# EAGLE design rcmix_v1 (EAGLE 7.3.0)
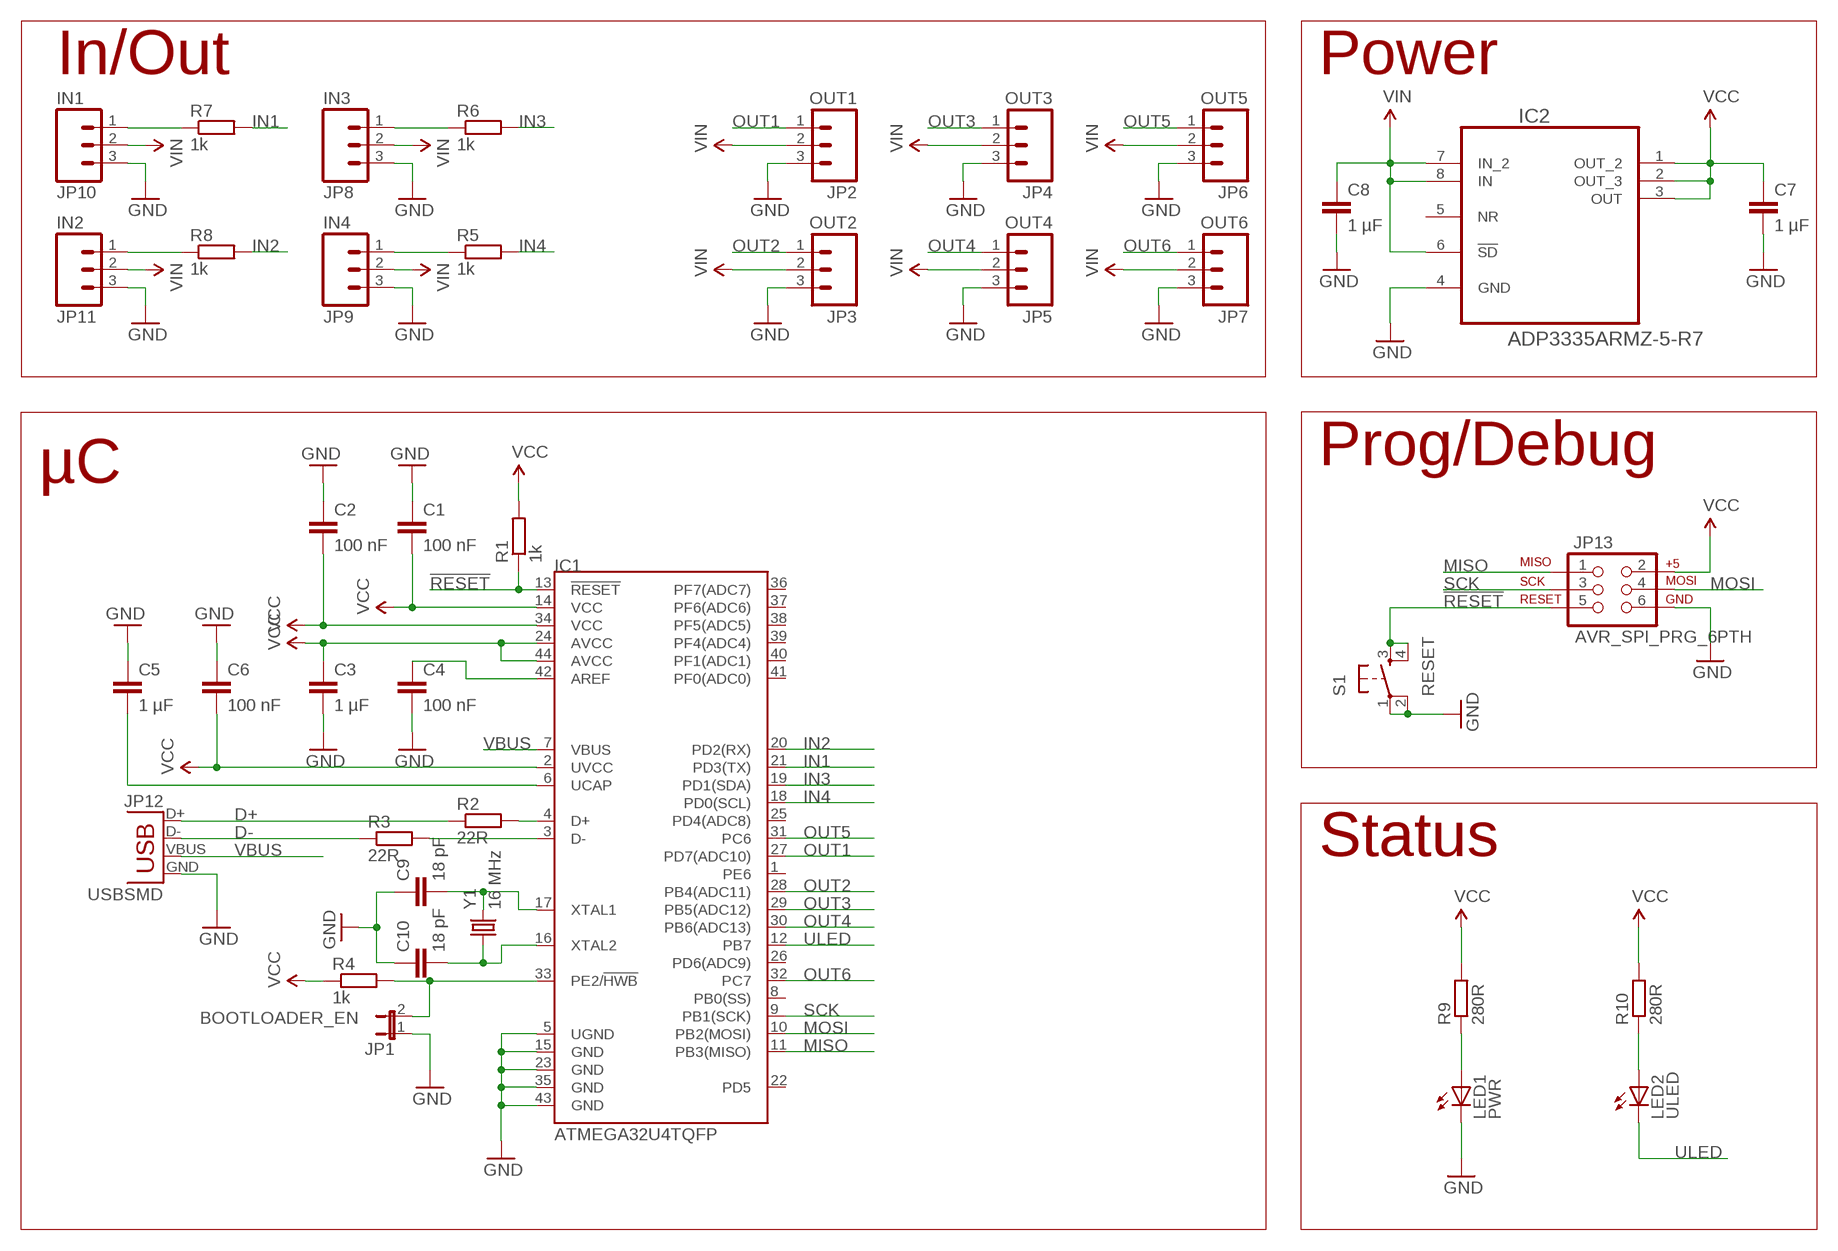
[diagram p0: schematic, sheet 1]

## Parts
C1  100 nF  C-EUC0603K  [C0603K]
C2  100 nF  C-EUC0603K  [C0603K]
C3  1 µF  C-EUC0603K  [C0603K]
C4  100 nF  C-EUC0603K  [C0603K]
C5  1 µF  C-EUC0603K  [C0603K]
C6  100 nF  C-EUC0603K  [C0603K]
C7  1 µF  C-EUC0603K  [C0603K]
C8  1 µF  C-EUC0603K  [C0603K]
C9  18 pF  C-EUC0603K  [C0603K]
C10  18 pF  C-EUC0603K  [C0603K]
IC1  ATMEGA32U4TQFP  [SPARKFUN-DIGITALIC_TQFP44]
IC2  ADP3335ARMZ-5-R7  [SOP65P490X110-8N]
JP1  BOOTLOADER_EN  JP1E  [JP1]
JP2  OUT1  M03PTH  [1X03]
JP3  OUT2  M03PTH  [1X03]
JP4  OUT3  M03PTH  [1X03]
JP5  OUT4  M03PTH  [1X03]
JP6  OUT5  M03PTH  [1X03]
JP7  OUT6  M03PTH  [1X03]
JP8  IN3  M03PTH  [1X03]
JP9  IN4  M03PTH  [1X03]
JP10  IN1  M03PTH  [1X03]
JP11  IN2  M03PTH  [1X03]
JP12  USBSMD  [USB-MINIB]
JP13  AVR_SPI_PRG_6PTH  [2X3]
LED1  PWR  LEDCHIP-LED0603  [CHIP-LED0603]
LED2  ULED  LEDCHIP-LED0603  [CHIP-LED0603]
R1  1k  R-EU_R0603  [R0603]
R2  22R  R-EU_R0603  [R0603]
R3  22R  R-EU_R0603  [R0603]
R4  1k  R-EU_R0603  [R0603]
R5  1k  R-EU_R0603  [R0603]
R6  1k  R-EU_R0603  [R0603]
R7  1k  R-EU_R0603  [R0603]
R8  1k  R-EU_R0603  [R0603]
R9  280R  R-EU_R0603  [R0603]
R10  280R  R-EU_R0603  [R0603]
S1  RESET  TAC_SWITCHPTH  [TACTILE-PTH]
Y1  16 MHz  CRYSTALTXC-7A  [CRYSTAL-TXC-7A]

## Nets
!RESET: IC1.13(!RESET) JP13.5 R1.1 S1.3 S1.4
D+: JP12.D+ R2.1
D-: JP12.D- R3.1
GND: C1.1 C2.1 C3.2 C4.2 C5.1 C6.1 C7.2 C8.2 C9.1 C10.1 IC1.5(UGND) IC1.15(GND) IC1.23(GND) IC1.35(GND) IC1.43(GND) IC2.4(GND) JP1.1 JP2.3 JP3.3 JP4.3 JP5.3 JP6.3 JP7.3 JP8.3 JP9.3 JP10.3 JP11.3 JP12.GND JP13.6 LED1.C S1.1 S1.2
IN1: IC1.21(PD3(TX)) R7.2
IN2: IC1.20(PD2(RX)) R8.2
IN3: IC1.19(PD1(SDA)) R6.2
IN4: IC1.18(PD0(SCL)) R5.2
MISO: IC1.11(PB3(MISO)) JP13.1
MOSI: IC1.10(PB2(MOSI)) JP13.4
N$1: IC1.4(D+) R2.2
N$2: IC1.3(D-) R3.2
N$3: C4.1 IC1.42(AREF)
N$5: C5.2 IC1.6(UCAP)
N$6: IC1.33(PE2/!HWB) JP1.2 R4.2
N$7: JP10.1 R7.1
N$8: JP11.1 R8.1
N$9: JP8.1 R6.1
N$10: JP9.1 R5.1
N$11: C9.2 IC1.17(XTAL1) Y1.P$2
N$12: LED1.A R9.1
N$13: C10.2 IC1.16(XTAL2) Y1.P$1
N$14: LED2.A R10.1
OUT1: IC1.27(PD7(ADC10)) JP2.1
OUT2: IC1.28(PB4(ADC11)) JP3.1
OUT3: IC1.29(PB5(ADC12)) JP4.1
OUT4: IC1.30(PB6(ADC13)) JP5.1
OUT5: IC1.31(PC6) JP6.1
OUT6: IC1.32(PC7) JP7.1
SCK: IC1.9(PB1(SCK)) JP13.3
ULED: IC1.12(PB7) LED2.C
VBUS: IC1.7(VBUS) JP12.VBUS
VCC: C1.2 C2.2 C3.1 C6.2 C7.1 IC1.2(UVCC) IC1.14(VCC) IC1.24(AVCC) IC1.34(VCC) IC1.44(AVCC) IC2.1(OUT_2) IC2.2(OUT_3) IC2.3(OUT) JP13.2 R1.2 R4.1 R9.2 R10.2
VIN: C8.1 IC2.6(!SD) IC2.7(IN_2) IC2.8(IN) JP2.2 JP3.2 JP4.2 JP5.2 JP6.2 JP7.2 JP8.2 JP9.2 JP10.2 JP11.2
Unconnected: IC1.1(PE6) IC1.8(PB0(SS)) IC1.22(PD5) IC1.25(PD4(ADC8)) IC1.26(PD6(ADC9)) IC1.36(PF7(ADC7)) IC1.37(PF6(ADC6)) IC1.38(PF5(ADC5)) IC1.39(PF4(ADC4)) IC1.40(PF1(ADC1)) IC1.41(PF0(ADC0)) IC2.5(NR)

## Notes on the sheet
- In/Out | Power
- µC | Prog/Debug
- Status

## Library data of the parts
C1-C10 = resistor:C-EU: CAPACITOR, European symbol
IC1 = SparkFun-DigitalIC:ATMEGA32U4: Atmel 44-pin 8-bit Microcontroller with 32KBytes of ISP Flash and USB Controller ----- Please use the QFN-44-NOPAD_1:1 package for the footprint of all boards using a 32U4. Route traces directly away from the pads as much as possible.; PROD_ID: IC-11161
IC2 = lxrobotics_ic:ADP3335ARMZ-5-R7: LDO, 5V, 500MA, 8-MSOP; MPN: ADP3335ARMZ-5-R7; OC_FARNELL: 2074873; OC_NEWARK: 67W2717; PACKAGE: 8-MSOP; SUPPLIER: ANALOG DEVICES
JP1 = jumper:JP1E: JUMPER
JP2-JP11 = SparkFun-Connectors:M03: Header 3 Standard 3-pin 0.1" header. Use with straight break away headers (SKU : PRT-00116), right angle break away headers (PRT-00553), swiss pins (PRT-00743), machine pins (PRT-00117), and female headers (PRT-00115). Molex polarized connector foot print use with SKU : PRT-08232 with associated crimp pins and housings.
JP12 = SparkFun-Connectors:USB: USB Connectors USB-B-PTH is fully proven SKU : PRT-00139/CONN-08278 USB-miniB is fully proven SKU : PRT-00587 USB-A-PCB is untested. USB-A-H is throughly reviewed, but untested. Spark Fun Electronics SKU : PRT-00437 USB-B-SMT is throughly reviewed, but untested. Needs silkscreen touching up. USB-A-S has not been used/tested USB-MB-H has not been used/tested USB-MICROB has been used. CONN-09505; PROD_ID: CONN-08193
JP13 = SparkFun-Connectors:AVR_SPI_PRG_6: AVR ISP 6 Pin This is the reduced ISP connector for AVR programming. Common on Arduino. This footprint will take up less PCB space and can be used with a 10-pin to 6-pin adapter such as SKU: BOB-08508 **Special note about "TEST_POINT" package. The stop mask is on the top side, so if you want your programming test points to be on the bottom of your board, make sure to place this package on the bottom side of the board. This also ensure that the orientation to program from the bottom side will be correct.
LED1 LED2 = led:LED: LED OSRAM: - CHIPLED LG R971, LG N971, LY N971, LG Q971, LY Q971, LO R971, LY R971 LH N974, LH R974 LS Q976, LO Q976, LY Q976 LO Q996 - Hyper CHIPLED LW Q18S LB Q993, LB Q99A, LB R99A - SideLED LS A670, LO A670, LY A670, LG A670, LP A670 LB A673, LV A673, LT A673, LW A673 LH A674 LY A675 LS A676, LA A676, LO A676, LY A676, LW A676 LS A679, LY A679, LG A679 - Hyper Micro SIDELED® LS Y876, LA Y876, LO Y876, LY Y876 LT Y87S - SmartLED LW L88C, LW L88S LB L89C, LB L89S, LG L890 LS L89K, LO L89K, LY L89K LS L896, LA L896, LO L896, LY L896 - TOPLED LS T670, LO T670, LY T670, LG T670, LP T670 LSG T670, LSP T670, LSY T670, LOP T670, LYG T670 LG T671, LOG T671, LSG T671 LB T673, LV T673, LT T673, LW T673 LH T674 LS T676, LA T676, LO T676, LY T676, LB T676, LH T676, LSB T676, LW T676 LB T67C, LV T67C, LT T67C, LS T67K, LO T67K, LY T67K, LW E67C LS E67B, LA E67B, LO E67B, LY E67B, LB E67C, LV E67C, LT E67C LW T67C LS T679, LY T679, LG T679 LS T770, LO T770, LY T770, LG T770, LP T770 LB T773, LV T773, LT T773, LW T773 LH T774 LS E675, LA E675, LY E675, LS T675 LS T776, LA T776, LO T776, LY T776, LB T776 LHGB T686 LT T68C, LB T68C - Hyper Mini TOPLED® LB M676 - Mini TOPLED Santana® LG M470 LS M47K, LO M47K, LY M47K Source: http://www.osram.convergy.de LUXEON: - LUMILED® LXK2-PW12-R00, LXK2-PW12-S00, LXK2-PW14-U00, LXK2-PW14-V00 LXK2-PM12-R00, LXK2-PM12-S00, LXK2-PM14-U00 LXK2-PE12-Q00, LXK2-PE12-R00, LXK2-PE12-S00, LXK2-PE14-T00, LXK2-PE14-U00 LXK2-PB12-K00, LXK2-PB12-L00, LXK2-PB12-M00, LXK2-PB14-N00, LXK2-PB14-P00, LXK2-PB14-Q00 LXK2-PR12-L00, LXK2-PR12-M00, LXK2-PR14-Q00, LXK2-PR14-R00 LXK2-PD12-Q00, LXK2-PD12-R00, LXK2-PD12-S00 LXK2-PH12-R00, LXK2-PH12-S00 LXK2-PL12-P00, LXK2-PL12-Q00, LXK2-PL12-R00 Source: www.luxeon.com KINGBRIGHT: KA-3528ASYC Source: www.kingbright.com
R1-R10 = resistor:R-EU_: RESISTOR, European symbol
S1 = SparkFun-Retired:TAC_SWITCH: Momentary Switch Button commonly used for reset or general input. Spark Fun Electronics SKU : COM-00097 SMT- SWCH-08247
Y1 = SparkFun-FreqCtrl:CRYSTAL: Various standard crystals. Proven footprints.

## Board
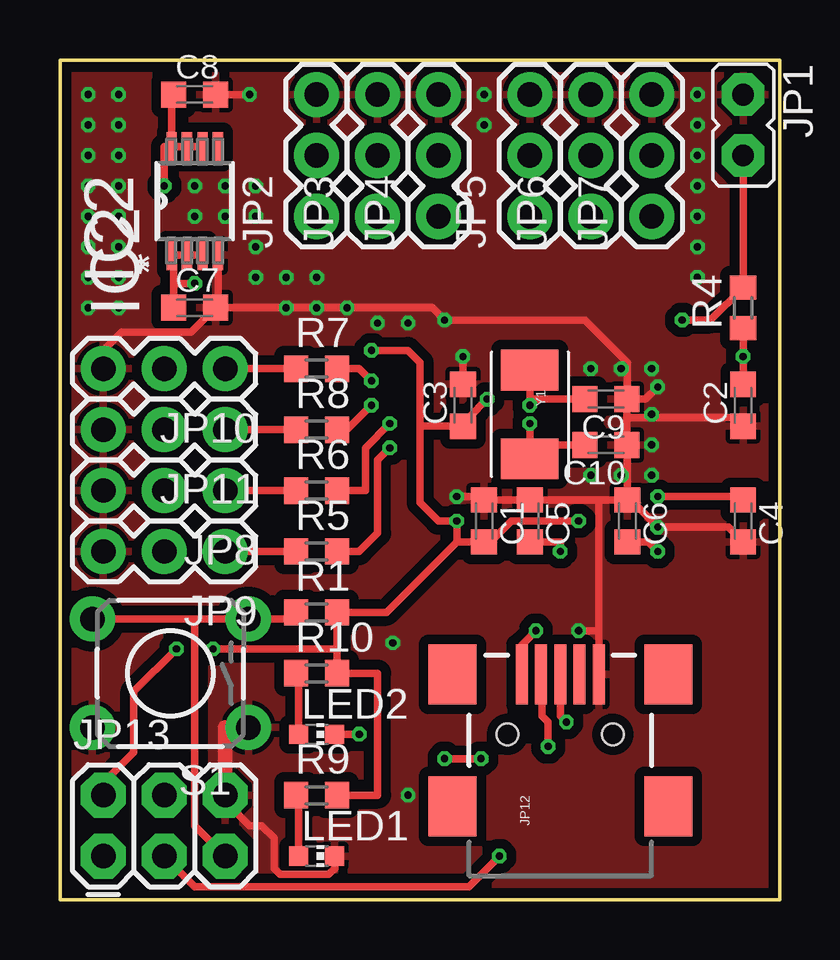
[diagram p1: board, top side]
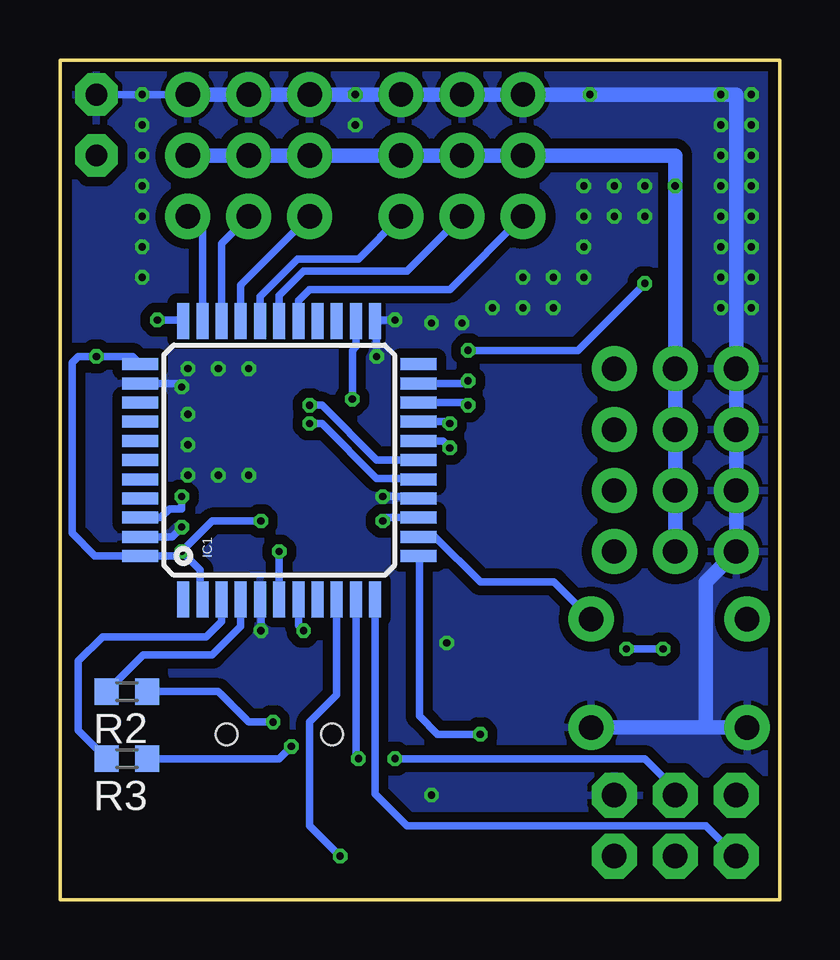
[diagram p2: board, bottom side, seen from below]

Size 30 x 35 mm. Coordinates in mm from the lower left corner, seen from the top.
Outline: 0,0 0,35 30,35 30,0 0,0
Copper layers (1*16): Top 0.035mm / dielectric 1.5mm / Bottom 0.035mm
Design rules "Eagle-DRU - 1506 - LeitOn - 01 and 02 layers - STANDARD": minimum track width 0.15mm, minimum drill 0.3mm, track to track 0.15mm, track to pad 0.15mm, pad to pad 0.15mm, via to via 0.15mm, smd to smd 0.15mm, copper to edge 0.2mm, drill to drill 0.25mm, minimum pad ring 0.15mm, minimum via ring 0.15mm, stop-mask expansion 0.05mm, vias tented up to drill 0mil, thermal gap 0.2mm

### Footprints (pad centres in the part's own frame; a part is rotated, then mirrored left to right if it is on the bottom)
C0603K = smd 1.05 x 1.08: 1 -0.875,0; 2 0.875,0
SPARKFUN-DIGITALIC_TQFP44 = smd 1.5 x 0.5: 1 -5.8,4; 2 -5.8,3.2; 3 -5.8,2.4; 4 -5.8,1.6; 5 -5.8,0.8; 6 -5.8,0; 7 -5.8,-0.8; 8 -5.8,-1.6; 9 -5.8,-2.4; 10 -5.8,-3.2; 11 -5.8,-4; 23 5.8,-4; 24 5.8,-3.2; 25 5.8,-2.4; 26 5.8,-1.6; 27 5.8,-0.8; 28 5.8,0; 29 5.8,0.8; 30 5.8,1.6; 31 5.8,2.4; 32 5.8,3.2; 33 5.8,4 | smd 0.5 x 1.5: 12 -4,-5.8; 13 -3.2,-5.8; 14 -2.4,-5.8; 15 -1.6,-5.8; 16 -0.8,-5.8; 17 0,-5.8; 18 0.8,-5.8; 19 1.6,-5.8; 20 2.4,-5.8; 21 3.2,-5.8; 22 4,-5.8; 34 4,5.8; 35 3.2,5.8; 36 2.4,5.8; 37 1.6,5.8; 38 0.8,5.8; 39 0,5.8; 40 -0.8,5.8; 41 -1.6,5.8; 42 -2.4,5.8; 43 -3.2,5.8; 44 -4,5.8
SOP65P490X110-8N = smd 1.245 x 0.432: 1 -2.261,0.965; 2 -2.261,0.33; 3 -2.261,-0.33; 4 -2.261,-0.965; 5 2.261,-0.965; 6 2.261,-0.33; 7 2.261,0.33; 8 2.261,0.965
JP1 = drill 0.914 pad 1.778 octagon: 1 0,-1.27; 2 0,1.27
1X03 = drill 1.016 pad 1.88: 1 0,0; 2 2.54,0; 3 5.08,0
USB-MINIB = smd 2.5 x 0.5: D+ 2.5,0; D- 2.5,0.8; GND 2.5,-1.6; ID 2.5,-0.8; VBUS 2.5,1.6 | smd 2.5 x 2: MTN1 -3,4.5; MTN2 2.5,4.5; MTN3 -3,-4.5; MTN4 2.5,-4.5 | hole 0.9: 0,2.2; 0,-2.2
2X3 = drill 1.016 pad 1.88 octagon: 1 0,0; 2 0,2.54; 3 2.54,0; 4 2.54,2.54; 5 5.08,0; 6 5.08,2.54
CHIP-LED0603 = smd 0.8 x 0.8: A 0,-0.75; C 0,0.75
R0603 = smd 1 x 1.1: 1 -0.85,0; 2 0.85,0
TACTILE-PTH = drill 1.016 pad 1.88: 1 -3.251,2.261; 2 3.251,2.261; 3 -3.251,-2.261; 4 3.251,-2.261
CRYSTAL-TXC-7A = smd 1.7 x 2.4: P$1 1.85,0; P$2 -1.85,0

### Placement (x,y rotation side)
C1  17.68,15.78 270 top
C2  28.48,20.61 90 top
C3  16.8,20.61 90 top
C4  28.48,15.78 270 top
C5  19.59,15.78 270 top
C6  23.65,15.78 270 top
C7  5.62,24.67 0 top
C8  5.62,33.56 0 top
C9  22.77,20.86 180 top
C10  22.77,18.95 180 top
IC1  20.86,18.32 90 bottom
IC2  5.62,29.11 90 top
JP1  28.48,32.29 180 top
JP2  10.7,28.48 90 top
JP3  13.24,28.48 90 top
JP4  15.78,28.48 90 top
JP5  19.59,28.48 90 top
JP6  22.13,28.48 90 top
JP7  24.67,28.48 90 top
JP8  6.89,17.05 180 top
JP9  6.89,14.51 180 top
JP10  6.89,22.13 180 top
JP11  6.89,19.59 180 top
JP12  20.86,6.89 90 top
JP13  1.81,1.81 0 top
LED1  10.7,1.81 270 top
LED2  10.7,6.89 270 top
R1  10.7,11.97 0 top
R2  27.21,8.67 180 bottom
R3  27.21,5.87 180 bottom
R4  28.48,24.67 90 top
R5  10.7,14.51 0 top
R6  10.7,17.05 0 top
R7  10.7,22.13 0 top
R8  10.7,19.59 0 top
R9  10.7,4.35 0 top
R10  10.7,9.43 0 top
S1  4.6,9.43 180 top
Y1  19.59,20.23 270 top

### Tracks (layer width: path | path; a pad name or v marks a point on that pad's centre or on a via)
!RESET
  Top 0.305: S1.4 5.62,11.69 | 5.62,11.69 S1.3 9.57,11.69 R1.1 | JP13.5 5.62,3.08 5.62,11.69
  Bottom 0.305: S1.3 9.4,13.24 12.48,13.24 14.36,15.12 IC1.13
D+  (via drill 0.3)
  Top 0.305: JP12.D+ 20.86,7.65 v21.11,7.4
  Bottom 0.305: v21.11,7.4 22.13,7.4 23.4,8.67 R2.1
D-  (via drill 0.3)
  Top 0.305: v20.35,6.38 20.35,7.4 20.1,7.65 20.1,9.35 JP12.D-
  Bottom 0.305: R3.1 20.86,5.87 v20.35,6.38
GND  (via drill 0.3)
  Top 0.305: JP13.6 6.89,4.1 7.91,3.08 8.41,3.08 8.92,2.57 8.92,1.3 9.18,1.05 11.21,1.05 11.46,1.3 11.46,1.8 LED1.C | 22.46,11.13 JP12.GND | C9.1 23.64,20.1 | 23.64,20.1 C10.1 23.65,18.94 C6.1 | v24.92,21.37 24.42,20.86 C9.1 | 22.46,16.66 C5.1 C1.1 17.54,16.8 v16.54,16.8 | 22.46,11.13 22.38,11.21 v21.62,11.21 | C6.1 22.46,16.66 | 22.46,16.66 22.46,11.13 | C6.1 23.8,16.66 v24.92,15.53 27.86,15.53 C4.2 | C2.1 28.37,20.1 23.64,20.1 | C7.2 6.59,24.67 IC2.4 | JP10.3 1.81,22.89 2.57,23.65 5.48,23.65 C7.2 | C8.2 v7.91,33.56 | C7.2 15.53,24.67 v16.03,24.16 21.88,24.16 23.65,22.38 23.65,20.87 C9.1 | C3.2 v16.8,22.64
  Top 0.61: JP13.6 6.89,7.17 S1.1
  Bottom 0.305: IC1.5 21.62,12.48 v21.62,11.21 | IC1.35 25.08,21.52 v24.92,21.37 | v16.54,16.8 15.06,16.8 IC1.15 | IC1.43 25.33,15.12 v24.92,15.53 | JP7.3 JP1.1 | v16.03,24.16 16.82,24.16 IC1.23 arc90 16.8,24.06 v16.8,22.64
  Bottom 0.61: S1.1 3.08,7.17 | 3.08,7.17 S1.2 | 3.08,7.17 3.08,13.24 JP9.3 JP8.3 JP11.3 JP10.3 1.81,33.56 v7.91,33.56 JP2.3 JP3.3 JP4.3 JP5.3 JP6.3 JP7.3
  other vias: 1.17,33.56 2.45,33.56 1.17,32.29 2.45,32.29 2.45,31.02 1.17,31.02 1.17,29.75 2.45,29.75 2.45,28.48 1.17,28.48 1.17,27.21 2.45,27.21 2.45,25.94 1.17,25.94 1.17,24.67 2.45,24.67 5.62,29.75 6.89,29.75 6.89,28.48 5.62,28.48 8.16,29.75 8.16,28.48 8.16,27.21 8.16,25.94 9.43,25.94 10.7,25.94 9.43,24.67 10.7,24.67 11.97,24.67 13.24,24.04 14.51,24.04 17.68,33.56 17.68,32.29 26.57,33.56 26.57,32.29 26.57,31.02 26.57,29.75 26.57,28.48 26.57,27.21 26.57,25.94 14.51,4.35 13.88,10.7 22.13,22.13 23.4,22.13 24.67,22.13 24.67,20.23 24.67,18.95 24.67,17.68 23.4,17.68 22.13,17.68
  pour Bottom (isolate 0.406): 0,35 30,35 30,0 0,0
  pour Top (isolate 0.406): 0,0 30,0 30,35 0,35
IN1  (via drill 0.3)
  Top 0.305: R7.2 12.48,22.13 v12.99,21.62
  Bottom 0.305: v12.99,21.62 13.09,21.52 IC1.21
IN2  (via drill 0.3)
  Top 0.305: R8.2 11.97,19.59 v12.99,20.61
  Bottom 0.305: v12.99,20.61 13.1,20.72 IC1.20
IN3  (via drill 0.3)
  Top 0.305: R6.2 12.73,17.05 12.73,18.83 v13.75,19.84
  Bottom 0.305: v13.75,19.84 13.82,19.92 IC1.19
IN4  (via drill 0.3)
  Top 0.305: R5.2 12.48,14.51 13.24,15.27 13.24,18.32 v13.75,18.83
  Bottom 0.305: v13.75,18.83 14.04,19.12 IC1.18
MISO
  Bottom 0.305: JP13.1 3.08,3.08 15.53,3.08 16.86,4.41 IC1.11
MOSI  (via drill 0.3)
  Top 0.305: v16.03,5.87 v17.56,5.87
  Bottom 0.305: JP13.4 4.35,4.6 5.62,5.87 v16.03,5.87 | v17.56,5.87 17.66,5.98 IC1.10
N$1
  Bottom 0.305: R2.2 26.54,10.19 23.65,10.19 22.46,11.39 IC1.4
N$2
  Bottom 0.305: R3.2 29.24,7.06 29.24,9.94 28.23,10.95 23.91,10.95 23.26,11.6 IC1.3
N$3  (via drill 0.3)
  Top 0.305: C4.1 28.34,16.8 v24.92,16.8
  Bottom 0.305: v24.92,16.8 24.92,16.29 25.43,16.29 25.8,15.92 IC1.42
N$5  (via drill 0.3)
  Top 0.305: C5.2 20.86,14.91 v20.86,14.51
  Bottom 0.305: v20.86,14.51 IC1.6
N$6  (via drill 0.3)
  Top 0.305: JP1.2 R4.2 27.12,24.16 v25.94,24.16
  Bottom 0.305: IC1.33 24.9,24.16 v25.94,24.16
N$7
  Top 0.305: JP10.1 R7.1
N$8
  Top 0.305: JP11.1 R8.1
N$9
  Top 0.305: JP8.1 R6.1
N$10
  Top 0.305: JP9.1 R5.1
N$11  (via drill 0.3)
  Top 0.305: Y1.P$2 v19.59,20.61 19.59,20.86 C9.2
  Bottom 0.305: IC1.17 16.8,18.32 19.08,20.61 v19.59,20.61
N$12
  Top 0.305: R9.1 9.95,4.35 LED1.A
N$13  (via drill 0.3)
  Top 0.305: Y1.P$1 v19.59,19.84 19.59,18.95 C10.2
  Bottom 0.305: IC1.16 15.1,17.56 16.8,17.56 19.08,19.84 v19.59,19.84
N$14
  Top 0.305: R10.1 9.95,9.43 LED2.A
OUT1
  Bottom 0.305: IC1.27 20.06,24.96 19.59,25.43 13.75,25.43 JP2.1
OUT2
  Bottom 0.305: IC1.28 20.86,25.18 19.84,26.19 15.53,26.19 JP3.1
OUT3
  Bottom 0.305: IC1.29 21.66,25.14 20.1,26.7 17.56,26.7 JP4.1
OUT4
  Bottom 0.305: IC1.30 22.46,25.61 JP5.1
OUT5
  Bottom 0.305: IC1.31 23.26,27.35 JP6.1
OUT6
  Bottom 0.305: IC1.32 24.06,27.87 JP7.1
SCK  (via drill 0.3)
  Top 0.305: JP13.3 5.62,0.54 17.05,0.54 v18.32,1.81
  Bottom 0.305: v18.32,1.81 19.59,3.08 19.59,7.4 18.46,8.53 IC1.9
ULED  (via drill 0.3)
  Top 0.305: LED2.C v12.48,6.89
  Bottom 0.305: v12.48,6.89 14.26,6.89 15.02,7.65 15.02,14.28 IC1.12
VBUS  (via drill 0.3)
  Top 0.305: v19.84,11.21 19.26,10.62 JP12.VBUS
  Bottom 0.305: IC1.7 20.06,11.42 v19.84,11.21
VCC  (via drill 0.3)
  Top 0.305: 11.55,10.45 R1.2 13.61,11.97 16.54,14.91 | 11.55,10.45 R10.2 13.24,9.43 13.24,4.35 R9.2 | JP13.2 1.81,4.86 3.08,6.13 3.08,8.67 v4.86,10.45 | v6.38,10.45 11.55,10.45 | 16.54,14.91 v16.54,15.78 15.78,15.78 15.02,16.54 15.02,19.73 | 16.54,14.91 C1.2 17.95,14.91 18.83,15.78 v21.62,15.78 | v24.92,14.51 24.53,14.91 C6.2 | C2.2 v28.48,22.64 R4.1 28.48,23.91 | v17.81,20.86 17.05,20.1 C3.1 15.02,19.73 | IC2.3 IC2.2 IC2.1 4.75,26.85 C7.1 4.75,25.69 v5.62,25.69 | v12.99,22.89 14.51,22.89 15.02,22.38 15.02,19.73
  Bottom 0.305: v4.86,10.45 v6.38,10.45 | IC1.14 16.54,15.92 v16.54,15.78 | v24.92,14.51 25.11,14.32 IC1.44 28.54,14.32 29.5,15.27 29.5,22.38 29.24,22.64 v28.48,22.64 26.98,22.64 IC1.34 | v17.81,20.86 17.81,22.89 17.66,23.04 IC1.24 | v21.62,15.78 23.65,15.78 v24.92,14.51 | v5.62,25.69 8.41,22.89 v12.99,22.89 | IC1.2 24.16,12.62 24.16,13.75 v24.92,14.51
VIN  (via drill 0.3)
  Top 0.305: IC2.8 IC2.7 IC2.6 | IC2.8 4.66,33.56 C8.1 | IC2.8 4.35,31.38 v4.35,29.75
  Bottom 0.61: JP9.2 JP8.2 JP11.2 JP10.2 4.35,28.48 v4.35,29.75 4.35,31.02 JP2.2 JP3.2 JP4.2 JP5.2 JP6.2 JP7.2